# EAGLE design SEGmeter20 (EAGLE 5.11)
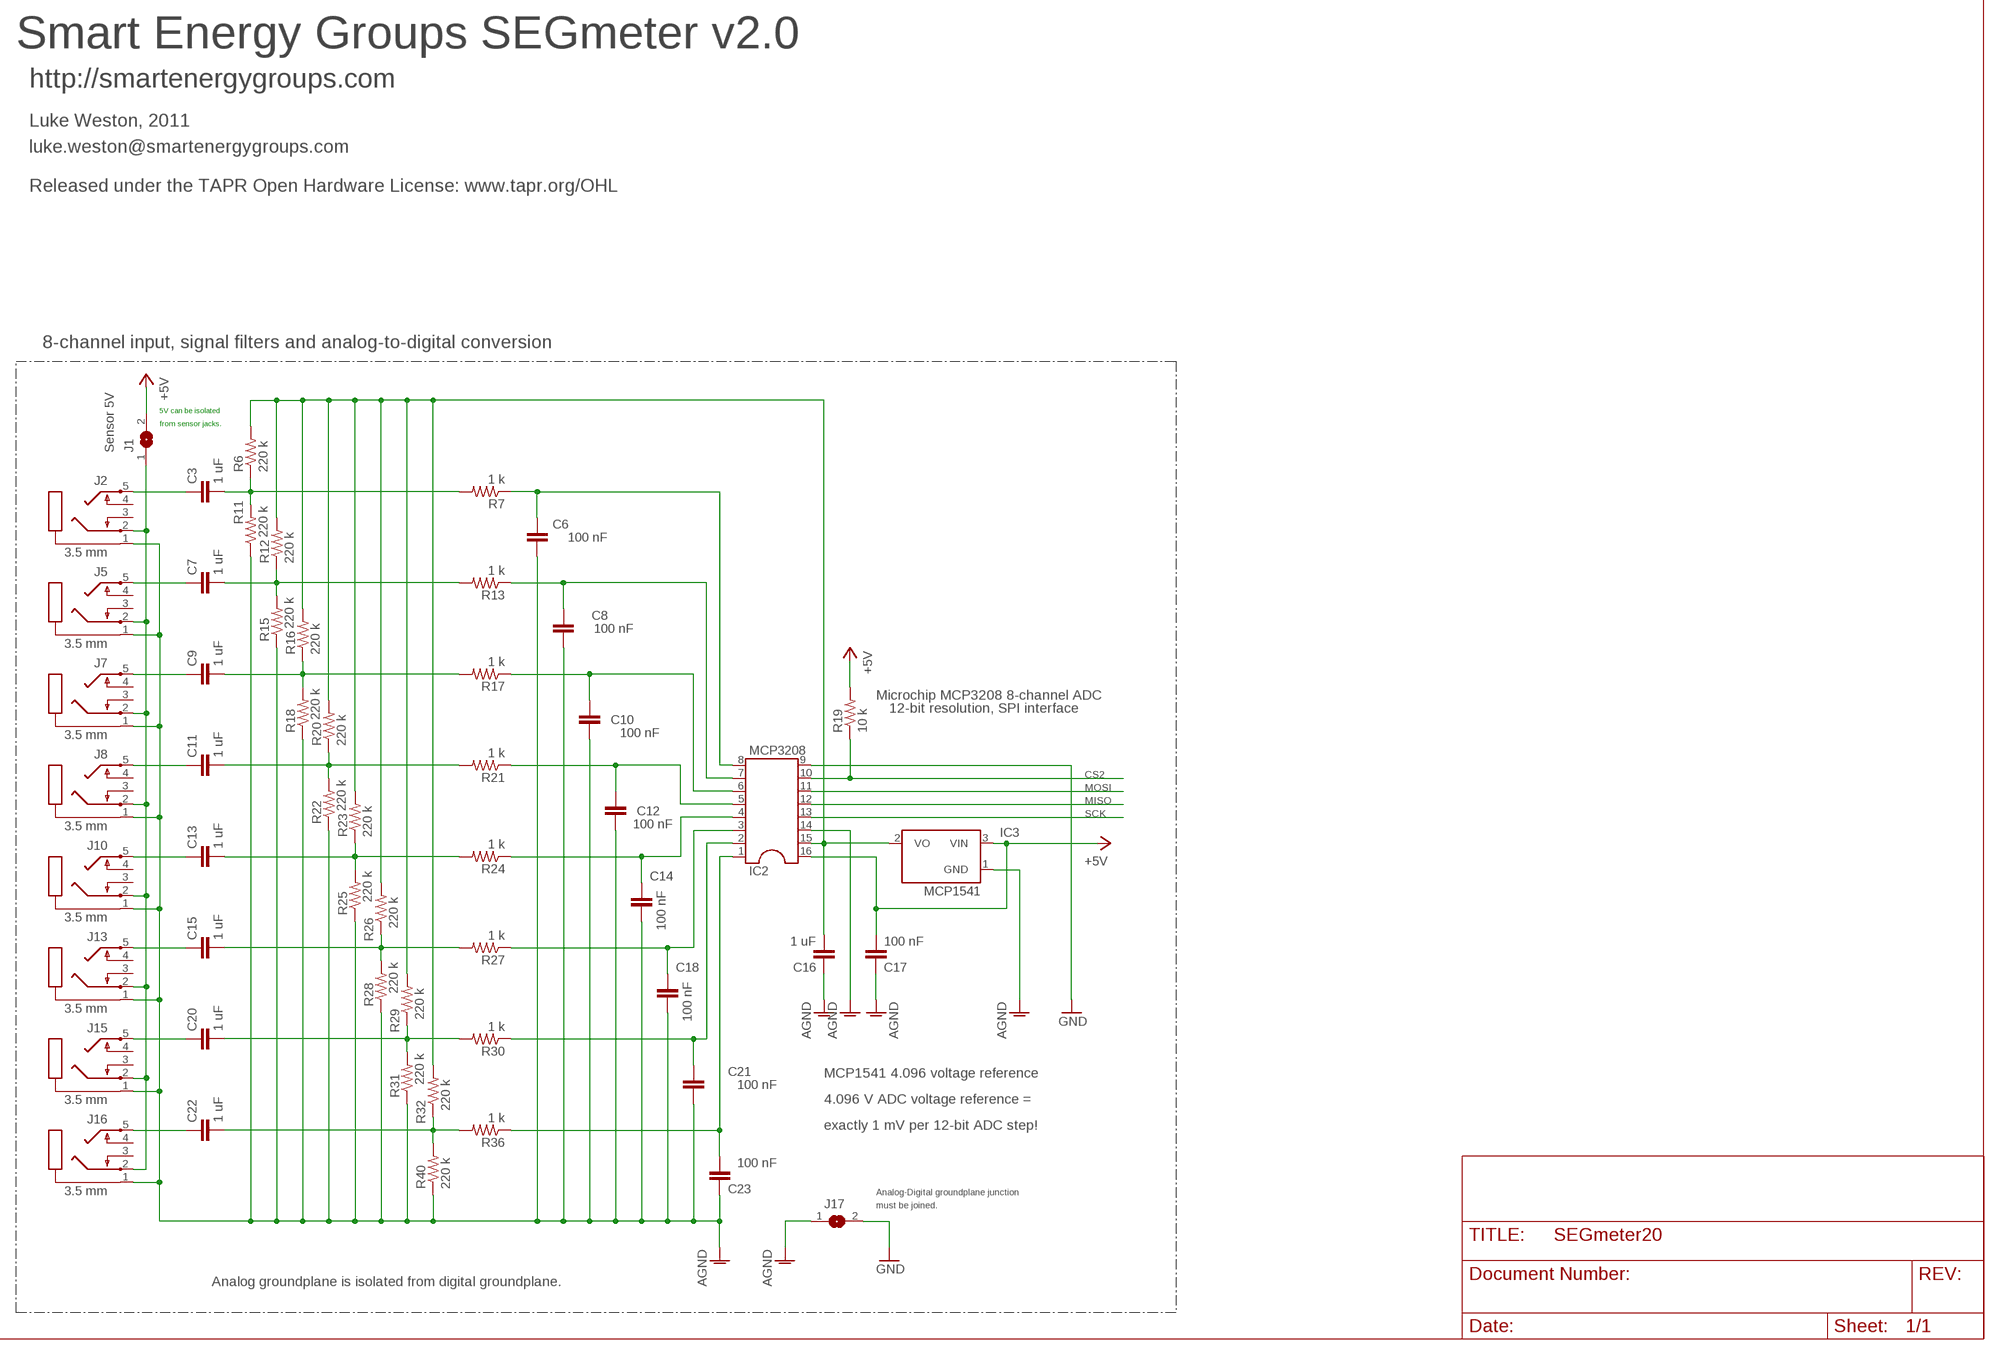
[diagram p0: schematic, sheet 1, part 1 of 2]
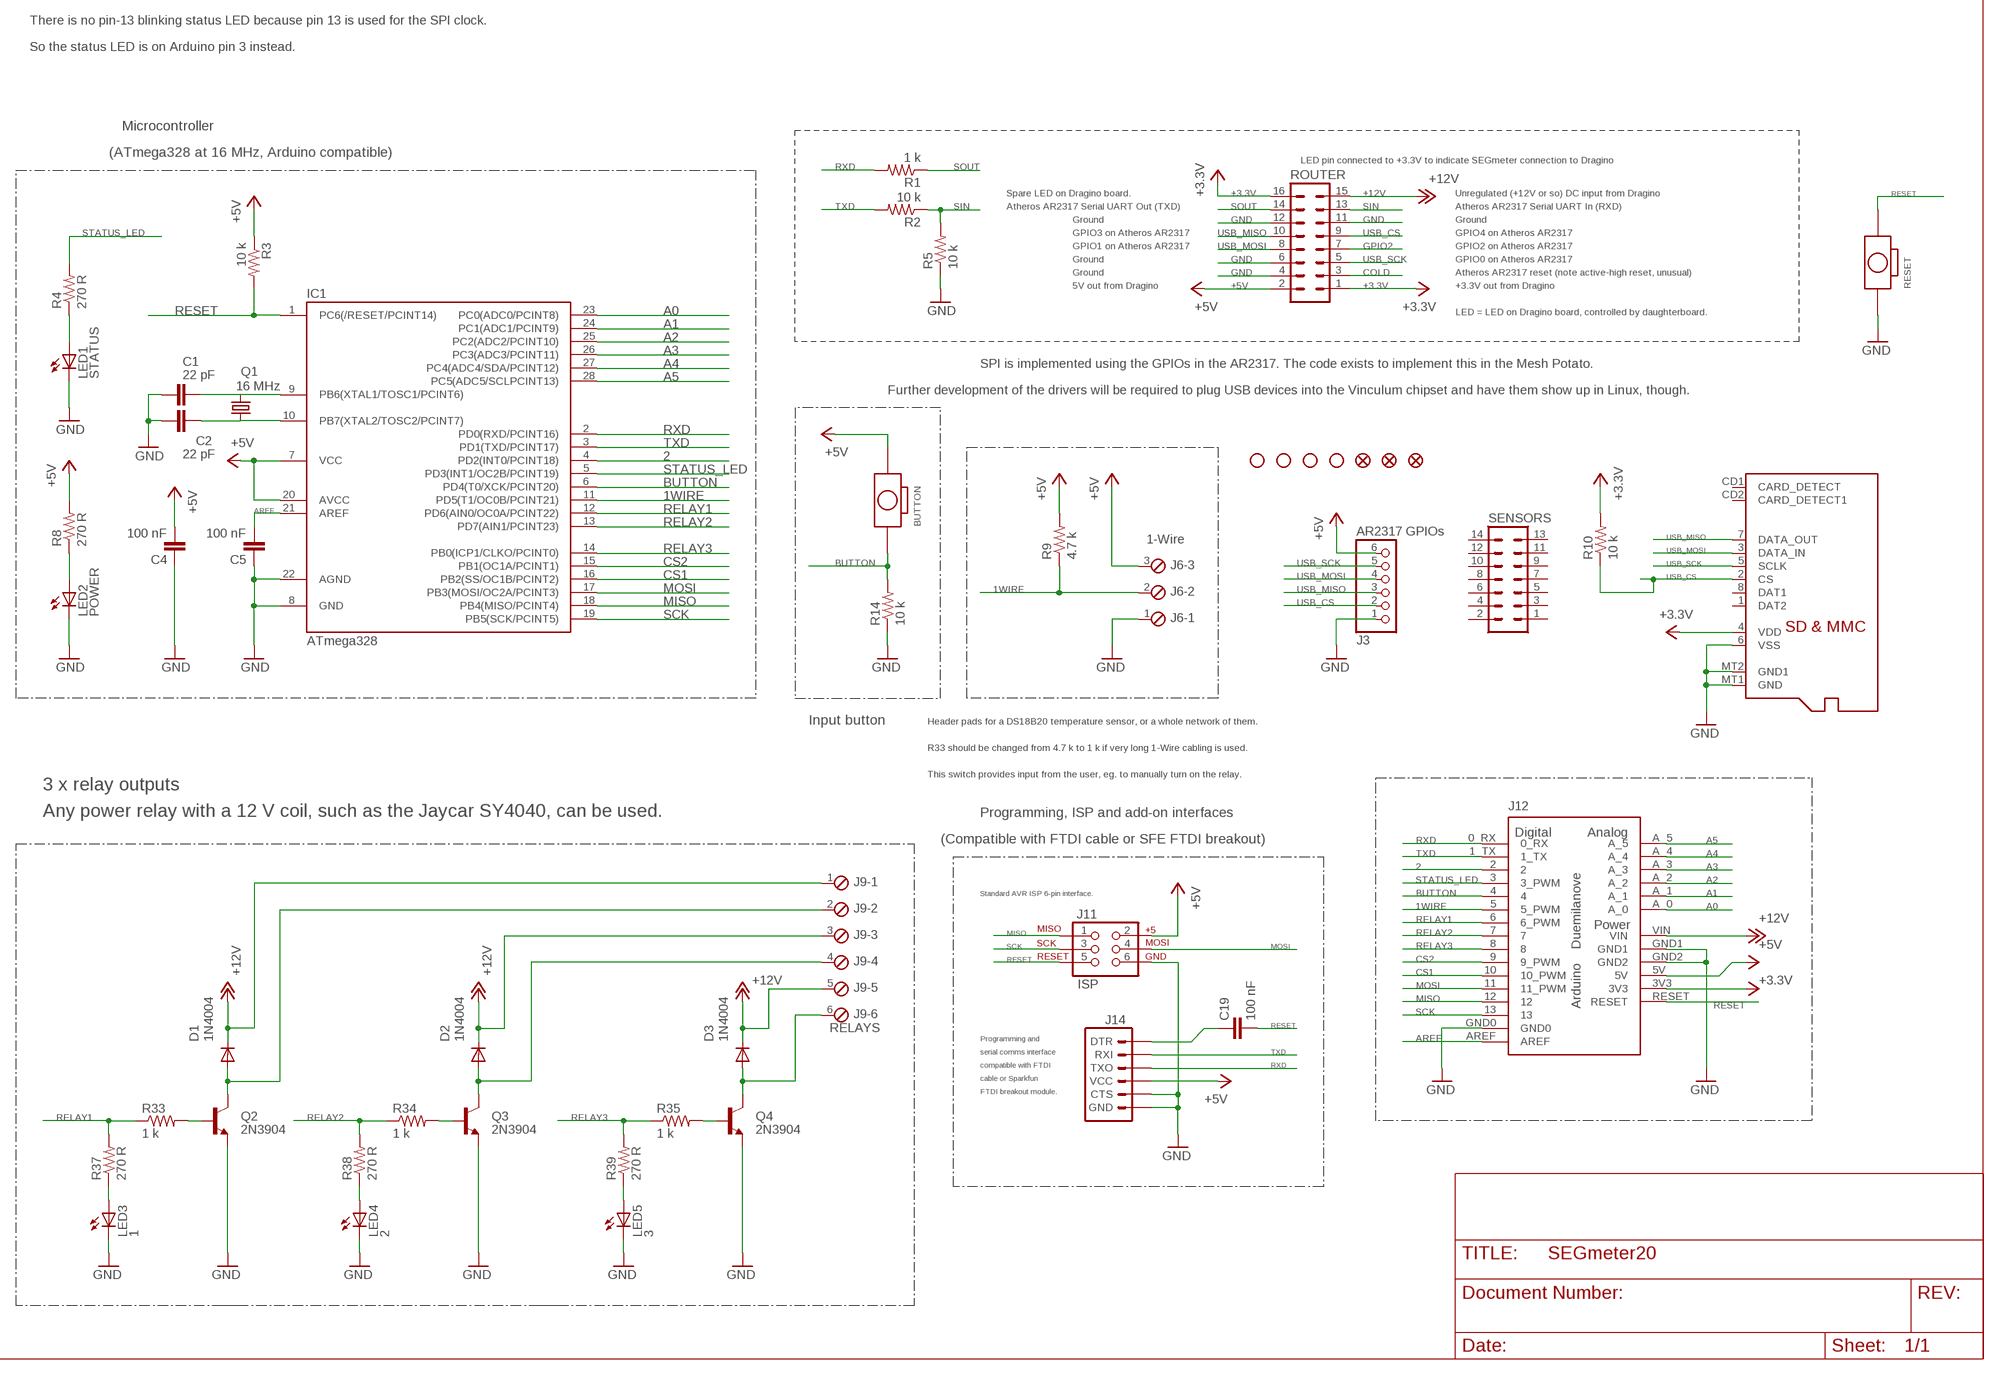
[diagram p1: schematic, sheet 1, part 2 of 2]

## Parts
BUTTON  BOTTON_1_DP  [BTN_5.0_RST]
C1  22 pF  C-EU025-024X044  [C025-024X044]
C2  22 pF  C-EU025-024X044  [C025-024X044]
C3  1 uF  C-EU050-024X044  [C050-024X044]
C4  100 nF  C-EU050-024X044  [C050-024X044]
C5  100 nF  C-EU050-024X044  [C050-024X044]
C6  100 nF  C-EU050-024X044  [C050-024X044]
C7  1 uF  C-EU050-024X044  [C050-024X044]
C8  100 nF  C-EU050-024X044  [C050-024X044]
C9  1 uF  C-EU050-024X044  [C050-024X044]
C10  100 nF  C-EU050-024X044  [C050-024X044]
C11  1 uF  C-EU050-024X044  [C050-024X044]
C12  100 nF  C-EU050-024X044  [C050-024X044]
C13  1 uF  C-EU050-024X044  [C050-024X044]
C14  100 nF  C-EU050-024X044  [C050-024X044]
C15  1 uF  C-EU050-024X044  [C050-024X044]
C16  1 uF  C-EU050-024X044  [C050-024X044]
C17  100 nF  C-EU050-024X044  [C050-024X044]
C18  100 nF  C-EU050-024X044  [C050-024X044]
C19  100 nF  C-EU050-024X044  [C050-024X044]
C20  1 uF  C-EU050-024X044  [C050-024X044]
C21  100 nF  C-EU050-024X044  [C050-024X044]
C22  1 uF  C-EU050-024X044  [C050-024X044]
C23  100 nF  C-EU050-024X044  [C050-024X044]
D1  1N4004  DIODEPTH  [DIODE-1N4001]
D2  1N4004  DIODEPTH  [DIODE-1N4001]
D3  1N4004  DIODEPTH  [DIODE-1N4001]
IC1  ATmega328  MEGA48/88/168-PU  [DIL28-3]
IC2  MCP3208  DIL16  [DIL16]
IC3  MCP1541  MC1541TO  [TO92]
J1  Sensor 5V  SJ  [SJ]
J2  3.5 mm  PG203J  [PG203J]
J3  AR2317 GPIOs  PINHD-1X6  [1X06]
J4  MICROSD  [MICROSD]
J5  3.5 mm  PG203J  [PG203J]
J6  1-Wire  MPT3  [3POL254]
J7  3.5 mm  PG203J  [PG203J]
J8  3.5 mm  PG203J  [PG203J]
J9  RELAYS  MPT6  [6POL254]
J10  3.5 mm  PG203J  [PG203J]
J11  ISP  AVR_SPI_PRG_6NS  [2X3-NS]
J12  ARDUINO-USBNO-OUTLINE-NO-TEXT-OCTAGONAL  [NO-OUTLINE-OCTAGONAL-NOTEXT]
J13  3.5 mm  PG203J  [PG203J]
J14  Comms  ARDUINO_SERIAL_PROGRAMLONGPADS  [1X06_LONGPADS]
J15  3.5 mm  PG203J  [PG203J]
J16  3.5 mm  PG203J  [PG203J]
J17  SJ  [SJ]
JP1  STAND-OFF  [STAND-OFF]
JP2  STAND-OFF  [STAND-OFF]
JP3  STAND-OFF  [STAND-OFF]
JP4  STAND-OFF  [STAND-OFF]
JP5  FIDUCIAL1.5X3  [FIDUCIAL-1.5X3]
JP6  FIDUCIAL1.5X3  [FIDUCIAL-1.5X3]
JP7  FIDUCIAL1.5X3  [FIDUCIAL-1.5X3]
LED1  STATUS  LED3MM  [LED3MM]
LED2  POWER  LED3MM  [LED3MM]
LED3  1  LED3MM  [LED3MM]
LED4  2  LED3MM  [LED3MM]
LED5  3  LED3MM  [LED3MM]
Q1  16 MHz  CRYSTALHC49US  [HC49US]
Q2  2N3904  TRANSISTOR_NPNTO92  [TO-92]
Q3  2N3904  TRANSISTOR_NPNTO92  [TO-92]
Q4  2N3904  TRANSISTOR_NPNTO92  [TO-92]
R1  1 k  R-US_0207/10  [0207/10]
R2  10 k  R-US_0207/10  [0207/10]
R3  10 k  R-US_0207/10  [0207/10]
R4  270 R  R-US_0207/10  [0207/10]
R5  10 k  R-US_0207/10  [0207/10]
R6  220 k  R-US_0207/10  [0207/10]
R7  1 k  R-US_0207/10  [0207/10]
R8  270 R  R-US_0207/10  [0207/10]
R9  4.7 k  R-US_0207/10  [0207/10]
R10  10 k  R-US_0207/10  [0207/10]
R11  220 k  R-US_0207/10  [0207/10]
R12  220 k  R-US_0207/10  [0207/10]
R13  1 k  R-US_0207/10  [0207/10]
R14  10 k  R-US_0207/10  [0207/10]
R15  220 k  R-US_0207/10  [0207/10]
R16  220 k  R-US_0207/10  [0207/10]
R17  1 k  R-US_0207/10  [0207/10]
R18  220 k  R-US_0207/10  [0207/10]
R19  10 k  R-US_0207/10  [0207/10]
R20  220 k  R-US_0207/10  [0207/10]
R21  1 k  R-US_0207/10  [0207/10]
R22  220 k  R-US_0207/10  [0207/10]
R23  220 k  R-US_0207/10  [0207/10]
R24  1 k  R-US_0207/10  [0207/10]
R25  220 k  R-US_0207/10  [0207/10]
R26  220 k  R-US_0207/10  [0207/10]
R27  1 k  R-US_0207/10  [0207/10]
R28  220 k  R-US_0207/10  [0207/10]
R29  220 k  R-US_0207/10  [0207/10]
R30  1 k  R-US_0207/10  [0207/10]
R31  220 k  R-US_0207/10  [0207/10]
R32  220 k  R-US_0207/10  [0207/10]
R33  1 k  R-US_0207/10  [0207/10]
R34  1 k  R-US_0207/10  [0207/10]
R35  1 k  R-US_0207/10  [0207/10]
R36  1 k  R-US_0207/10  [0207/10]
R37  270 R  R-US_0207/10  [0207/10]
R38  270 R  R-US_0207/10  [0207/10]
R39  270 R  R-US_0207/10  [0207/10]
R40  220 k  R-US_0207/10  [0207/10]
RESET  BOTTON_1_DP  [BTN_5.0_RST]
ROUTER  MA08-2  [MA08-2]
SENSORS  MA07-2  [MA07-2]

## Nets
1WIRE: IC1.11(PD5(T1/OC0B/PCINT21)) J6.2 J12.5(5_PWM) R9.1
2: IC1.4(PD2(INT0/PCINT18)) J12.2
+3.3V: J4.4(VDD) J12.3V3 R10.2 ROUTER.1 ROUTER.16
+5V: BUTTON.P$2 C4.2 C17.2 IC1.7(VCC) IC1.20(AVCC) IC2.16 IC3.3(VIN) J1.2 J3.6 J6.3 J11.2 J12.5V J14.4(VCC) R3.1 R8.2 R9.2 R19.2 ROUTER.2
+12V: D1.C D2.C D3.C J9.1 J9.3 J9.5 J12.VIN ROUTER.15
A0: IC1.23(PC0(ADC0/PCINT8)) J12.A_0
A1: IC1.24(PC1(ADC1/PCINT9)) J12.A_1
A2: IC1.25(PC2(ADC2/PCINT10)) J12.A_2
A3: IC1.26(PC3(ADC3/PCINT11)) J12.A_3
A4: IC1.27(PC4(ADC4/SDA/PCINT12)) J12.A_4
A5: IC1.28(PC5(ADC5/SCLPCINT13)) J12.A_5
AGND: C6.1 C8.1 C10.1 C12.1 C14.1 C16.1 C17.1 C18.1 C21.1 C23.1 IC2.14 IC3.1(GND) J2.1 J5.1 J7.1 J8.1 J10.1 J13.1 J15.1 J16.1 J17.1 R11.1 R15.1 R18.1 R22.1 R25.1 R28.1 R31.1 R40.1
AREF: C5.2 IC1.21(AREF) J12.AREF
BUTTON: BUTTON.P$1 IC1.6(PD4(T0/XCK/PCINT20)) J12.4 R14.2
COLD: ROUTER.3
CS1: IC1.16(PB2(SS/OC1B/PCINT2)) J12.10(10_PWM)
CS2: IC1.15(PB1(OC1A/PCINT1)) IC2.10 J12.9(9_PWM) R19.1
GND: C1.2 C2.2 C4.1 C5.1 IC1.8(GND) IC1.22(AGND) IC2.9 J3.1 J4.6(VSS) J4.MT1(GND) J4.MT2(GND1) J6.1 J11.6 J12.GND0 J12.GND1 J12.GND2 J14.5(CTS) J14.6(GND) J17.2 LED1.K(C) LED2.K(C) LED3.K(C) LED4.K(C) LED5.K(C) Q2.1(E) Q3.1(E) Q4.1(E) R5.1 R14.1 RESET.P$1 ROUTER.4 ROUTER.6 ROUTER.11 ROUTER.12
GPIO2: ROUTER.7
MISO: IC1.18(PB4(MISO/PCINT4)) IC2.12 J11.1 J12.12
MOSI: IC1.17(PB3(MOSI/OC2A/PCINT3)) IC2.11 J11.4 J12.11(11_PWM)
N$1: C3.2 R6.1 R7.2 R11.2
N$2: C20.1 J15.5
N$3: C22.1 J16.5
N$4: C16.2 IC2.15 IC3.2(VO) R6.2 R12.2 R16.2 R20.2 R23.2 R26.2 R29.2 R32.2
N$5: C7.2 R12.1 R13.2 R15.2
N$6: C6.2 IC2.8 R7.1
N$7: C15.1 J13.5
N$8: C13.1 J10.5
N$9: C11.1 J8.5
N$10: C3.1 J2.5
N$11: C7.1 J5.5
N$12: C9.1 J7.5
N$13: C8.2 IC2.7 R13.1
N$14: C10.2 IC2.6 R17.1
N$15: C12.2 IC2.5 R21.1
N$16: C23.2 IC2.1 R36.1
N$17: C21.2 IC2.2 R30.1
N$18: C15.2 R26.1 R27.2 R28.2
N$19: C18.2 IC2.3 R27.1
N$20: C14.2 IC2.4 R24.1
N$21: C22.2 R32.1 R36.2 R40.2
N$22: C20.2 R29.1 R30.2 R31.2
N$23: D1.A J9.2 Q2.3(C)
N$24: C13.2 R23.1 R24.2 R25.2
N$25: LED3.A R37.1
N$26: C11.2 R20.1 R21.2 R22.2
N$27: C9.2 R16.1 R17.2 R18.2
N$28: C1.1 IC1.9(PB6(XTAL1/TOSC1/PCINT6)) Q1.2
N$29: C2.1 IC1.10(PB7(XTAL2/TOSC2/PCINT7)) Q1.1
N$30: C19.1 J14.1(DTR)
N$31: D2.A J9.4 Q3.3(C)
N$32: Q2.2(B) R33.2
N$33: LED4.A R38.1
N$34: Q3.2(B) R34.2
N$35: D3.A J9.6 Q4.3(C)
N$36: LED5.A R39.1
N$37: Q4.2(B) R35.2
N$38: LED2.A R8.1
N$39: LED1.A R4.1
N$40: J1.1 J2.2 J5.2 J7.2 J8.2 J10.2 J13.2 J15.2 J16.2
RELAY1: IC1.12(PD6(AIN0/OC0A/PCINT22)) J12.6(6_PWM) R33.1 R37.2
RELAY2: IC1.13(PD7(AIN1/PCINT23)) J12.7 R34.1 R38.2
RELAY3: IC1.14(PB0(ICP1/CLKO/PCINT0)) J12.8 R35.1 R39.2
RESET: C19.2 IC1.1(PC6(/RESET/PCINT14)) J11.5 J12.RESET R3.2 RESET.P$2
RXD: IC1.2(PD0(RXD/PCINT16)) J12.0_RX J14.3(TXO) R1.2
SCK: IC1.19(PB5(SCK/PCINT5)) IC2.13 J11.3 J12.13
SIN: R2.1 R5.2 ROUTER.13
SOUT: R1.1 ROUTER.14
STATUS_LED: IC1.5(PD3(INT1/OC2B/PCINT19)) J12.3(3_PWM) R4.2
TXD: IC1.3(PD1(TXD/PCINT17)) J12.1_TX J14.2(RXI) R2.2
USB_CS: J3.2 J4.2(CS) R10.1 ROUTER.9
USB_MISO: J3.3 J4.7(DATA_OUT) ROUTER.10
USB_MOSI: J3.4 J4.3(DATA_IN) ROUTER.8
USB_SCK: J3.5 J4.5(SCLK) ROUTER.5
Unconnected: J2.3 J2.4 J4.1(DAT2) J4.8(DAT1) J4.CD1(CARD_DETECT) J4.CD2(CARD_DETECT1) J5.3 J5.4 J7.3 J7.4 J8.3 J8.4 J10.3 J10.4 J13.3 J13.4 J15.3 J15.4 J16.3 J16.4 SENSORS.1 SENSORS.2 SENSORS.3 SENSORS.4 SENSORS.5 SENSORS.6 SENSORS.7 SENSORS.8 SENSORS.9 SENSORS.10 SENSORS.11 SENSORS.12 SENSORS.13 SENSORS.14

## Notes on the sheet
- Smart Energy Groups SEGmeter v2.0
- http://smartenergygroups.com
- Luke Weston, 2011
- luke.weston@smartenergygroups.com
- Released under the TAPR Open Hardware License: www.tapr.org/OHL
- 8-channel input, signal filters and analog-to-digital conversion
- 5V can be isolated
- from sensor jacks.
- Microchip MCP3208 8-channel ADC
- 12-bit resolution, SPI interface
- MCP1541 4.096 voltage reference
- 4.096 V ADC voltage reference =
- exactly 1 mV per 12-bit ADC step!
- Analog-Digital groundplane junction
- must be joined.
- Analog groundplane is isolated from digital groundplane.
- There is no pin-13 blinking status LED because pin 13 is used for the SPI clock.
- So the status LED is on Arduino pin 3 instead.
- Microcontroller
- (ATmega328 at 16 MHz, Arduino compatible) | LED pin connected to +3.3V to indicate SEGmeter connection to Dragino
- Spare LED on Dragino board. | Unregulated (+12V or so) DC input from Dragino
- Atheros AR2317 Serial UART Out (TXD) | Atheros AR2317 Serial UART In (RXD)
- Ground | Ground
- GPIO3 on Atheros AR2317 | GPIO4 on Atheros AR2317
- GPIO1 on Atheros AR2317 | GPIO2 on Atheros AR2317
- Ground | GPIO0 on Atheros AR2317
- Ground | Atheros AR2317 reset (note active-high reset, unusual)
- 5V out from Dragino | +3.3V out from Dragino
- LED = LED on Dragino board, controlled by daughterboard.
- SPI is implemented using the GPIOs in the AR2317. The code exists to implement this in the Mesh Potato.
- Further development of the drivers will be required to plug USB devices into the Vinculum chipset and have them show up in Linux, though.
- Input button | Header pads for a DS18B20 temperature sensor, or a whole network of them.
- R33 should be changed from 4.7 k to 1 k if very long 1-Wire cabling is used.
- This switch provides input from the user, eg. to manually turn on the relay.
- 3 x relay outputs
- Any power relay with a 12 V coil, such as the Jaycar SY4040, can be used. | Programming, ISP and add-on interfaces
- (Compatible with FTDI cable or SFE FTDI breakout)
- Standard AVR ISP 6-pin interface.
- Programming and
- serial comms interface
- compatible with FTDI
- cable or Sparkfun
- FTDI breakout module.

## Library data of the parts
BUTTON RESET = CPT_SMD:BOTTON_1
C1-C23 = rcl:C-EU: CAPACITOR, European symbol
D1-D3 = SparkFun:DIODE: Diode These are standard reverse protection diodes and small signal diodes. SMA package can handle up to about 1A. SOD-323 can handle about 200mA. What the SOD-323 package when ordering, there are some mfgs out there that are 5-pin packages.
IC1 = avr-5:MEGA48/88/168-PU
IC2 = ic-package:DIL16: Dual In Line / Socket
IC3 = microchip:MC15*: 2.5V and 4.096V Voltage References Source: http://www.microchip.com .. 21653b.pdf; OC_FARNELL: unknown; OC_NEWARK: unknown
J1 J17 = jumper:SJ: SMD solder JUMPER
J2 J5 J7 J8 J10 J13 J15 J16 = con-hirschmann:PG203J: MIC/HEADPHONE JACK KS-S stereo microphone/headphone jack PG203JN (Schukat); OC_FARNELL: unknown; OC_NEWARK: unknown
J3 = pinhead:PINHD-1X6: PIN HEADER
J4 = adafruit:MICROSD: Micro-SD / Transflash card holder with SPI pinout For the 3M # 2908-05WB-MG and/or 4UCON #19656 push-push type
J6 = con-phoenix-254:MPT3: PHOENIX CONNECTOR; OC_FARNELL: unknown; OC_NEWARK: unknown
J9 = con-phoenix-254:MPT6: PHOENIX CONNECTOR; OC_FARNELL: unknown; OC_NEWARK: unknown
J11 = SparkFun:AVR_SPI_PRG_6: AVR ISP 6 Pin This is the reduced ISP connector for AVR programming. Common on Arduino. This footprint will take up less PCB space and can be used with a 10-pin to 6-pin adapter such as SKU: BOB-08508
J12 = Arduino-Various:ARDUINO-USB: The Ardiuno Duemilanove Pinouts layoutet as a Bare Shield. v0.5 Also for Arduino Diecimila. This is designed as a Part and has no Outline in the Dimension Layer. The Outline, when present, is drawed at the tPlace / bPlace Layer. Library by Stephanie Lange, http://www.k-ita.de/~sl/
J14 = SparkFun:ARDUINO_SERIAL_PROGRAM
JP1-JP4 = SparkFun:STAND-OFF: Stand Off This is the mechanical footprint for a #4 phillips button head screw. Use the keepout ring to avoid running the screw head into surrounding components. SKU : PRT-00447
JP5-JP7 = SparkFun:FIDUCIAL: Fiducial Alignment Points Various fiducial points for machine vision alignment.
LED1-LED5 = SparkFun:LED: LEDs Standard schematic elements and footprints for 5mm, 3mm, 1206, and 0603 sized LEDs. 5mm - Spark Fun Electronics SKU : COM-00529 (and others)
Q1 = SparkFun:CRYSTAL: Crystals Various standard crystals. Proven footprints. Spark Fun Electronics SKU : COM-00534
Q2-Q4 = SparkFun:TRANSISTOR_NPN: Transistor NPN BJT configuration in SOT23 package. MMBT2222 is the common NPN we use. Double check BCE configuration again layout.
R1-R40 = rcl:R-US_: RESISTOR, American symbol
ROUTER = con-lstb:MA08-2: PIN HEADER; OC_FARNELL: unknown; OC_NEWARK: unknown
SENSORS = con-lstb:MA07-2: PIN HEADER; OC_FARNELL: unknown; OC_NEWARK: unknown

## Board
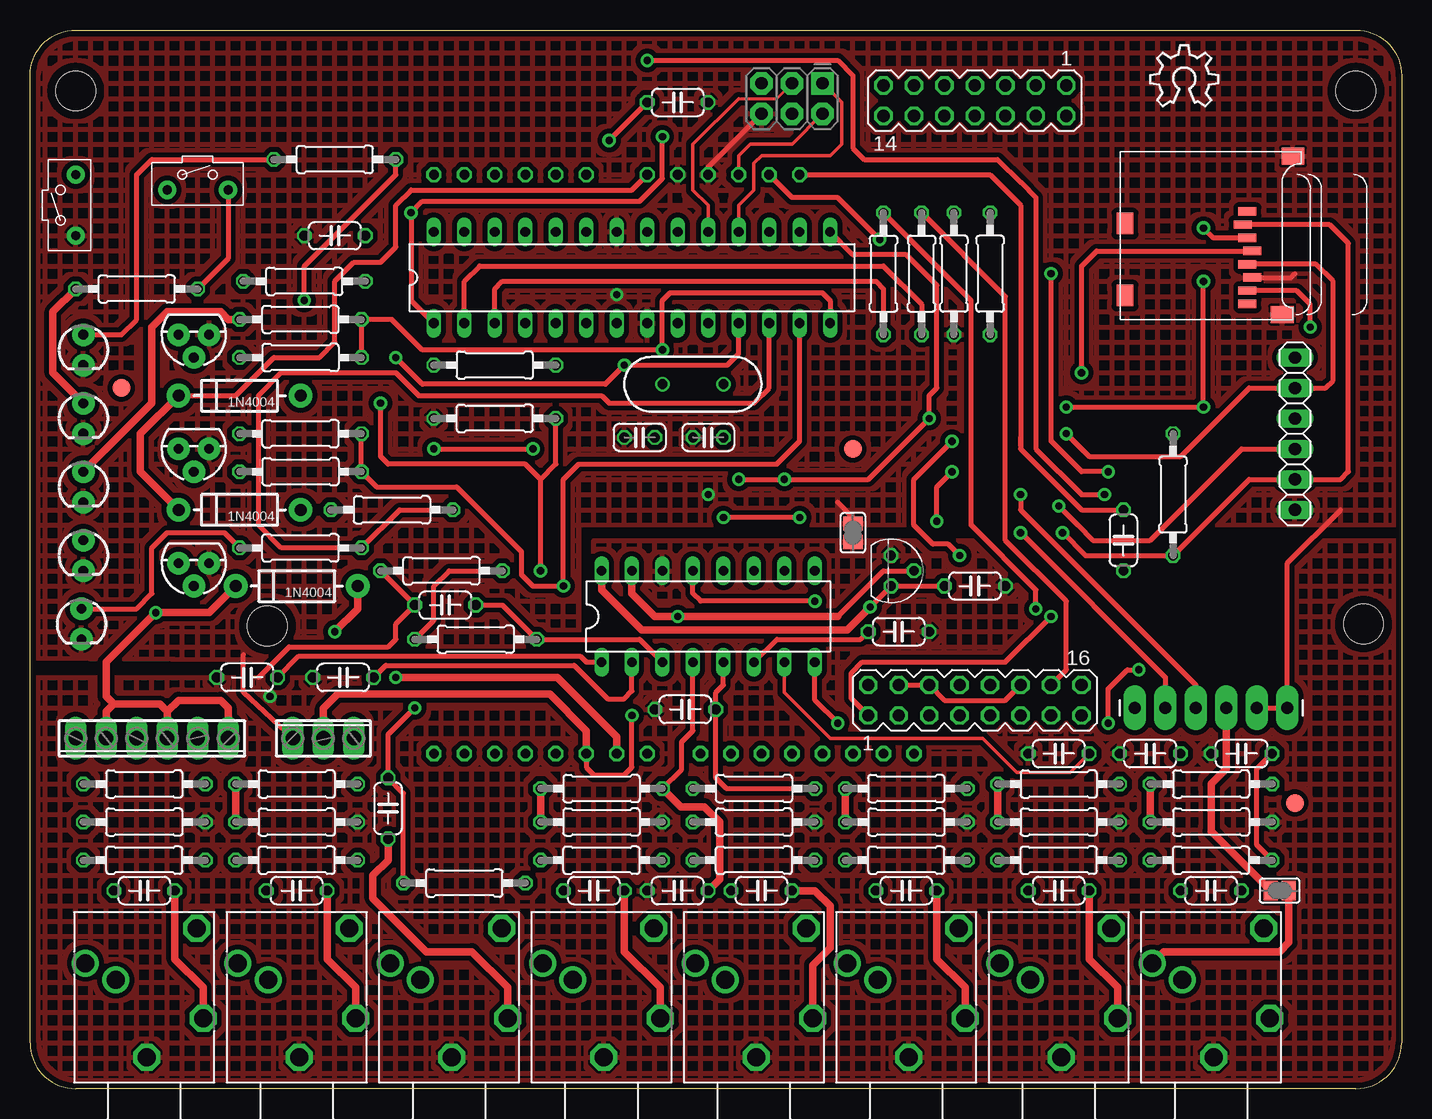
[diagram p2: board, top side]
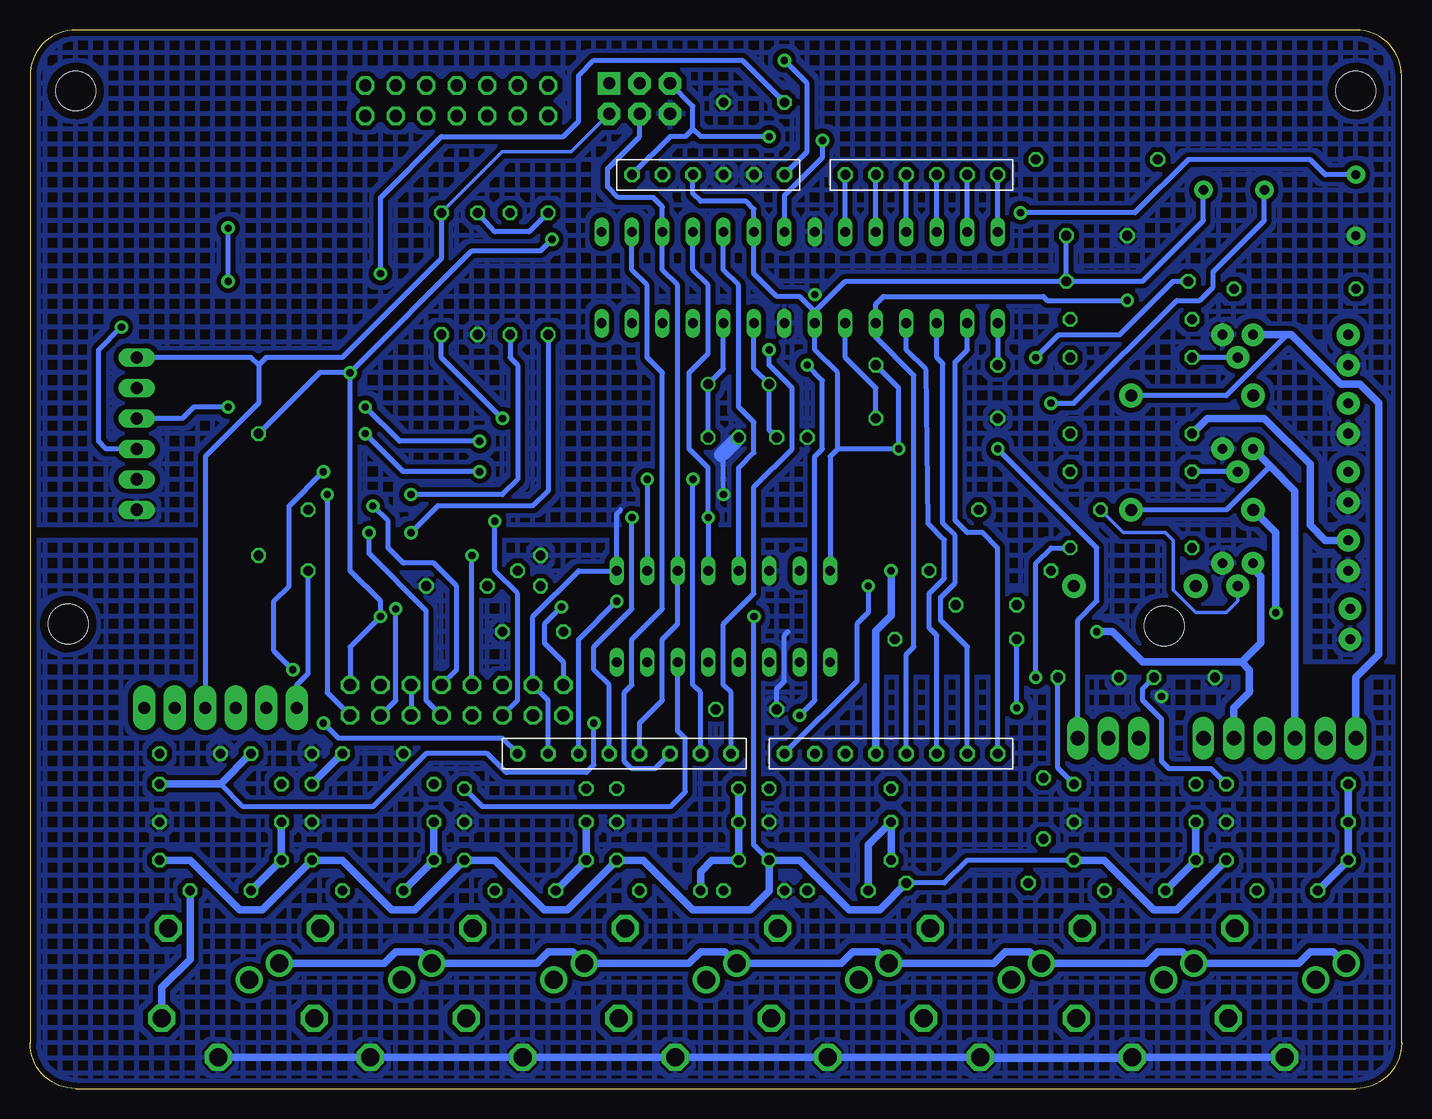
[diagram p3: board, bottom side, seen from below]

Size 114.3 x 88.27 mm. Coordinates in mm from the lower left corner, seen from the top.
Outline: 110.49,0 3.81,0 arc-90 0,3.81 0,84.46 arc-90 3.81,88.27 110.49,88.27 arc-90 114.3,84.46 114.3,3.81 arc-90 110.49,0
Copper layers (1*16): Top 0.035mm / dielectric 1.5mm / Bottom 0.035mm
Design rules "PCBCart-Standard": minimum track width 8mil, minimum drill 0.4mm, track to track 8mil, track to pad 8mil, pad to pad 8mil, via to via 8mil, smd to smd 8mil, copper to edge 20mil, drill to drill 8mil, minimum pad ring 8mil, minimum via ring 10mil, stop-mask expansion 3mil, vias tented up to drill 0mil, thermal gap 8mil

### Footprints (pad centres in the part's own frame; a part is rotated, then mirrored left to right if it is on the bottom)
BTN_5.0_RST = drill 0.762 pad 1.524 round: P$1 0,2.54; P$2 0,-2.54
C025-024X044 = drill 0.813 octagon: 1 -1.27,0; 2 1.27,0
C050-024X044 = drill 0.813 octagon: 1 -2.54,0; 2 2.54,0
DIODE-1N4001 = drill 1 pad 1.981 round: A -5.08,0; C 5.08,0
DIL28-3 = drill 0.813 long: 1 -16.51,-3.81; 2 -13.97,-3.81; 3 -11.43,-3.81; 4 -8.89,-3.81; 5 -6.35,-3.81; 6 -3.81,-3.81; 7 -1.27,-3.81; 8 1.27,-3.81; 9 3.81,-3.81; 10 6.35,-3.81; 11 8.89,-3.81; 12 11.43,-3.81; 13 13.97,-3.81; 14 16.51,-3.81; 15 16.51,3.81; 16 13.97,3.81; 17 11.43,3.81; 18 8.89,3.81; 19 6.35,3.81; 20 3.81,3.81; 21 1.27,3.81; 22 -1.27,3.81; 23 -3.81,3.81; 24 -6.35,3.81; 25 -8.89,3.81; 26 -11.43,3.81; 27 -13.97,3.81; 28 -16.51,3.81
DIL16 = drill 0.813 long: 1 -8.89,-3.81; 2 -6.35,-3.81; 3 -3.81,-3.81; 4 -1.27,-3.81; 5 1.27,-3.81; 6 3.81,-3.81; 7 6.35,-3.81; 8 8.89,-3.81; 9 8.89,3.81; 10 6.35,3.81; 11 3.81,3.81; 12 1.27,3.81; 13 -1.27,3.81; 14 -3.81,3.81; 15 -6.35,3.81; 16 -8.89,3.81
TO92 = drill 0.813 octagon: 1 -1.27,0; 2 0,1.905; 3 1.27,0
SJ = smd 1.168 x 1.6: 1 -0.762,0; 2 0.762,0
PG203J = drill 1.499 octagon: 1 -5.004,-0.203; 4 5.74,-4.369; 5 -1.753,-4.902 | drill 1.499 round: 2 2.845,4.902; 3 1.448,2.388
1X06 = drill 1.016 long: 1 -6.35,0; 2 -3.81,0; 3 -1.27,0; 4 1.27,0; 5 3.81,0; 6 6.35,0
MICROSD = smd 0.7 x 1.5: 1 9,-10.64; 2 7.9,-10.24; 3 6.8,-10.64; 4 5.7,-11.04; 5 4.6,-10.64; 6 3.5,-11.04; 7 2.4,-10.64; 8 1.3,-10.64 | smd 1.8 x 1.4: CD1 2,-0.44; CD2 8,-0.44 | smd 1.4 x 1.9: MT1 0.4,-13.54; MT2 13.6,-14.44
3POL254 = drill 1.2 long: 1 -2.54,0; 2 0,0; 3 2.54,0
6POL254 = drill 1.2 pad 1.778 long: 1 -6.35,0; 2 -3.81,0; 3 -1.27,0; 4 1.27,0; 5 3.81,0; 6 6.35,0
2X3-NS = drill 1.016 pad 1.88 square: 1 -2.54,-1.27 | drill 1.016 pad 1.88 octagon: 2 -2.54,1.27; 3 0,-1.27; 4 0,1.27; 5 2.54,-1.27; 6 2.54,1.27
NO-OUTLINE-OCTAGONAL-NOTEXT = drill 0.8 pad 1.27 octagon: 0_RX -25.4,27.94; 1_TX -25.4,25.4; 2 -25.4,22.86; 3 -25.4,20.32; 3V3 22.86,0; 4 -25.4,17.78; 5 -25.4,15.24; 5V 22.86,2.54; 6 -25.4,12.7; 7 -25.4,10.16; 8 -25.4,5.715; 9 -25.4,3.175; 10 -25.4,0.635; 11 -25.4,-1.905; 12 -25.4,-4.445; 13 -25.4,-6.985; A_0 22.86,15.24; A_1 22.86,17.78; A_2 22.86,20.32; A_3 22.86,22.86; A_4 22.86,25.4; A_5 22.86,27.94; AREF -25.4,-12.065; GND0 -25.4,-9.525; GND1 22.86,7.62; GND2 22.86,5.08; RESET 22.86,-2.54; VIN 22.86,10.16
1X06_LONGPADS = drill 1.016 pad 1.88 long: 1 0,0; 2 2.54,0; 3 5.08,0; 4 7.62,0; 5 10.16,0; 6 12.7,0
STAND-OFF = hole 3.302: 0,0
FIDUCIAL-1.5X3 = smd 1.5 x 1.5: 1 0,0
LED3MM = drill 0.813 pad 1.88 round: A -1.27,0; K 1.27,0
HC49US = drill 0.813 round: 1 -2.54,0; 2 2.54,0
TO-92 = drill 0.813 pad 1.88 round: 1 -1.27,0; 2 0,1.905; 3 1.27,0
0207/10 = drill 0.813 octagon: 1 -5.08,0; 2 5.08,0
MA08-2 = drill 1.016 octagon: 1 -8.89,-1.27; 2 -8.89,1.27; 3 -6.35,-1.27; 4 -6.35,1.27; 5 -3.81,-1.27; 6 -3.81,1.27; 7 -1.27,-1.27; 8 -1.27,1.27; 9 1.27,-1.27; 10 1.27,1.27; 11 3.81,-1.27; 12 3.81,1.27; 13 6.35,-1.27; 14 6.35,1.27; 15 8.89,-1.27; 16 8.89,1.27
MA07-2 = drill 1.016 octagon: 1 -7.62,-1.27; 2 -7.62,1.27; 3 -5.08,-1.27; 4 -5.08,1.27; 5 -2.54,-1.27; 6 -2.54,1.27; 7 0,-1.27; 8 0,1.27; 9 2.54,-1.27; 10 2.54,1.27; 11 5.08,-1.27; 12 5.08,1.27; 13 7.62,-1.27; 14 7.62,1.27

### Placement (x,y rotation side)
BUTTON  13.97,74.93 90 top
C1  50.8,54.29 180 top
C2  56.52,54.29 180 top
C3  98.42,16.51 180 top
C4  25.4,71.12 0 top
C5  53.98,82.23 180 top
C6  93.34,27.94 0 top
C7  85.73,16.51 180 top
C8  85.73,27.94 0 top
C9  73.03,16.51 180 top
C10  72.39,38.1 180 top
C11  60.96,16.51 180 top
C12  54.61,31.62 0 top
C13  46.99,16.51 180 top
C14  53.98,16.51 0 top
C15  29.84,23.37 90 top
C16  100.97,27.94 0 top
C17  78.74,41.91 180 top
C18  34.61,40.32 0 top
C19  91.12,45.72 90 top
C20  22.22,16.51 180 top
C21  26.1,34.29 0 top
C22  9.53,16.51 180 top
C23  18.1,34.29 0 top
D1  22.22,41.91 180 top
D2  17.46,48.26 180 top
D3  17.46,57.78 180 top
IC1  50.16,67.63 0 top
IC2  56.52,39.37 0 top
IC3  71.75,43.18 270 top
J1  104.14,16.51 180 top
J2  98.42,7.62 90 top
J3  105.41,54.61 90 top
J4  90.81,64.14 90 top
J5  85.73,7.62 90 top
J6  24.45,29.21 0 top
J7  73.03,7.62 90 top
J8  60.33,7.62 90 top
J9  10.16,29.21 180 top
J10  47.62,7.62 90 top
J11  63.5,82.55 180 top
J12  61.59,53.34 90 top
J13  34.92,7.62 90 top
J14  92.08,31.75 0 top
J15  22.22,7.62 90 top
J16  9.53,7.62 90 top
J17  68.58,46.35 90 top
JP1  19.78,38.58 0 top
JP2  3.81,83.19 0 top
JP3  110.49,83.19 0 top
JP4  111.12,38.73 180 top
JP5  7.62,58.42 0 top
JP6  105.41,23.81 0 top
JP7  68.58,53.34 0 top
LED1  4.45,61.59 270 top
LED2  4.45,55.88 270 top
LED3  4.29,38.73 270 top
LED4  4.45,44.45 270 top
LED5  4.45,50.16 270 top
Q1  55.25,58.74 180 top
Q2  13.65,43.81 180 top
Q3  13.65,53.34 180 top
Q4  13.65,62.87 180 top
R1  74.3,67.95 270 top
R2  71.12,67.95 270 top
R3  38.73,60.32 180 top
R4  25.4,77.47 0 top
R5  76.99,67.95 90 top
R6  98.42,19.05 0 top
R7  98.42,25.4 180 top
R8  8.89,66.68 0 top
R9  22.86,67.31 0 top
R10  95.25,49.53 90 top
R11  98.42,22.22 180 top
R12  85.73,19.05 0 top
R13  85.73,25.4 180 top
R14  38.73,55.88 0 top
R15  85.73,22.22 180 top
R16  73.03,19.05 0 top
R17  73.03,25.02 180 top
R18  73.03,22.22 180 top
R19  80.01,67.95 90 top
R20  60.33,19.05 0 top
R21  60.33,25.02 180 top
R22  60.33,22.22 180 top
R23  47.62,19.05 0 top
R24  47.62,25.02 180 top
R25  47.62,22.22 180 top
R26  36.2,17.14 0 top
R27  37.15,37.46 180 top
R28  34.29,43.18 0 top
R29  22.22,19.05 0 top
R30  22.22,25.4 180 top
R31  22.22,22.22 180 top
R32  9.53,19.05 0 top
R33  30.16,48.26 180 top
R34  22.54,51.44 180 top
R35  22.54,60.96 180 top
R36  9.53,25.4 180 top
R37  22.54,45.09 0 top
R38  22.54,54.61 0 top
R39  22.54,64.14 0 top
R40  9.53,22.22 180 top
RESET  3.81,73.66 180 top
ROUTER  78.74,32.38 0 top
SENSORS  78.74,82.37 180 top
U$1  [OSHW_8X200_NOTEXT]  93.34,81.92 0 top

### Tracks (layer width: path | path; a pad name or v marks a point on that pad's centre or on a via)
1WIRE  (via drill 0.6)
  Top 0.406: IC1.11 59.05,61.28 58.1,60.32 v49.53,60.32 47.94,58.74 32.7,58.74 v30.48,60.96 | v50.16,31.11 50.16,26.8 49.53,26.16 46.99,26.16 46.36,26.8 J12.5
  Top 0.61: J6.2 24.45,31.69 25.65,32.89 43.31,32.89 46.36,29.84 J12.5
  Bottom 0.406: v49.53,60.32 48.26,59.05 48.26,53.34 48.9,52.7 48.9,32.38 v50.16,31.11 | v30.48,60.96 28.57,62.87 24.13,62.87 23.49,62.87 19.05,67.31 R9.1
2
  Bottom 0.406: IC1.4 41.28,61.59 39.62,59.94 39.47,47.12 38.1,45.75 38.1,42.55 39.37,41.27 39.37,38.42 38.73,37.78 J12.2
+3.3V  (via drill 0.6)
  Top 0.406: v70.8,70.8 67.31,74.3 63.5,74.3 J12.3V3 | ROUTER.1 | ROUTER.1 68.42,32.54 68.42,34.61 69.37,35.56 81.28,35.56 v85.09,39.37 | J4.4 88.89,69.84 87.63,68.58 v87.63,59.69
  Bottom 0.406: v70.8,70.8 71.75,69.85 77.47,69.85 v87.63,59.69 | ROUTER.16 87.63,36.83 v85.09,39.37 85.09,40.64 87.63,43.18 v87.63,59.69 | R10.2 90.17,59.69 v87.63,59.69
+5V  (via drill 0.6)
  Top 0.305: J12.5V 59.05,77.79 60.01,78.74 63.5,78.74 J11.2
  Top 0.406: IC3.3 C17.2 | C17.2 | IC3.3 | v70.01,40.16 IC3.3 | v33.66,53.34 v41.91,53.34 | R8.2 16.51,69.22 BUTTON.P$2
  Top 0.61: IC2.16 47.62,41.59 50.96,38.26 68.1,38.26 | J14.4 99.7,26.67 98.42,25.4 98.42,21.46 J1.2 | 68.1,38.26 | 68.1,38.26 v70.01,40.16
  Bottom 0.305: J11.2 69.22,78.11 74.93,78.11 R19.2
  Bottom 0.406: 46.99,53.34 47.62,52.7 IC2.16 | R3.1 41.91,58.42 v41.91,53.34 46.99,53.34 | 48.9,64.77 46.36,67.31 R9.2 | 48.9,64.77 IC1.7 48.9,61.59 46.99,59.69 46.99,53.34 | 48.9,64.77 50.16,66.04 52.07,66.04 53.98,67.95 IC1.20 53.98,73.34 54.61,73.98 58.42,73.98 59.05,74.61 J12.5V | J14.4 99.7,52.7 95.25,57.15 95.25,60.32 | 95.25,60.32 94.62,60.96 88.27,60.96 80.01,69.22 R19.2 | J3.6 95.89,60.96 95.25,60.32 | v70.01,40.16 | v70.01,40.16 71.44,38.73 71.44,37.15 69.85,35.56 ROUTER.2 | R9.2 C4.2 | J6.3 26.99,39.05 25.4,40.64 25.4,45.09 v33.66,53.34 | R9.2 21.59,67.31 16.51,72.39 BUTTON.P$2 | IC3.3
+12V  (via drill 0.6)
  Top 0.406: D3.C 17.14,57.78 20.32,60.96 24.13,60.96 25.4,62.23 25.4,67.31 26.99,68.9 29.21,68.9 30.48,70.17 30.48,73.66 31.75,74.93 50.16,74.93 J12.VIN | v51.44,85.73 67.31,85.73 68.58,84.46 68.58,78.42 69.53,77.47 80.64,77.47 82.55,75.57 83.82,74.3 83.82,53.34 87.63,49.53 v89.53,49.53
  Top 0.61: D2.C 9.21,51.44 9.21,54.61 D3.C | J9.5 6.35,31.43 6.98,32.07 | 6.98,32.07 10.79,32.07 11.43,31.43 | 11.43,31.43 J9.3 | 11.43,31.43 12.38,32.38 15.88,32.38 16.51,31.75 J9.1 | 6.98,32.07 6.35,32.7 6.35,35.56 v10.48,39.69 14.92,39.69 D1.C
  Bottom 0.406: v51.44,85.73 49.53,83.82 49.53,78.11 J12.VIN | v89.53,49.53 89.53,33.02 ROUTER.15
  Bottom 0.61: v10.48,39.69 10.48,46.35 D2.C
A0
  Bottom 0.406: IC1.23 J12.A_0
A1
  Bottom 0.406: IC1.24 J12.A_1
A2
  Bottom 0.406: IC1.25 J12.A_2
A3
  Bottom 0.406: IC1.26 J12.A_3
A4
  Bottom 0.406: IC1.27 J12.A_4
A5
  Bottom 0.406: IC1.28 J12.A_5
AGND  (via drill 0.6)
  Top 0.406: R28.1 C18.1 30.48,38.73 30.48,37.46 29.84,36.83 21.59,36.83 19.05,34.29
  Bottom 0.406: C12.1 52.07,33.34 51.44,33.97 51.44,37.78 51.12,38.1
  Bottom 0.61: J2.1 J5.1 J7.1 61.04,2.62 60.96,2.54 60.6,2.54 J8.1 J10.1 J13.1 | J13.1 35.48,2.62 35.56,2.54 34.29,2.54 | J13.1 J15.1 J16.1 | 34.29,2.54 22.86,2.54 | J13.1 34.37,2.62 34.29,2.54
  other vias: 20,32.7
  pour Bottom (isolate 0.406, hatched): -1.9,34.29 46.99,34.29 46.99,45.72 116.2,45.72 116.2,-1.91 -1.9,-1.91
  pour Top (isolate 0.406, hatched): -2.54,34.29 46.99,34.29 46.99,45.72 116.2,45.72 116.2,-2.54 -2.54,-2.54
AREF  (via drill 0.6)
  Top 0.406: v89.85,51.44 87.63,51.44 85.09,53.98 v85.09,67.95 | C5.2 v48.26,79.06 | v92.39,34.92 91.44,34.92 89.85,33.34 v89.85,30.48
  Bottom 0.406: v89.85,51.44 92.71,48.58 92.71,41.91 93.98,40.64 93.98,36.51 v92.39,34.92 | IC1.21 51.44,74.45 48.26,77.63 v48.26,79.06 | C5.2 54.93,85.73 67.31,85.73 68.58,84.46 68.58,80.65 69.85,79.38 80.01,79.38 85.09,74.3 v85.09,67.95 | J12.AREF 74.93,29.21 88.58,29.21 v89.85,30.48
BUTTON  (via drill 0.6)
  Top 0.406: v42.55,43.18 42.55,50.8 | 42.55,50.8 43.82,52.07 R14.2 | 42.55,50.8 41.28,52.07 29.84,52.07 29.21,52.7 v29.21,57.15
  Bottom 0.406: IC1.6 46.36,60.96 43.82,58.42 R14.2 | v29.21,57.15 27.3,57.15 18.73,65.72 16.83,65.72 15.72,66.83 15.72,68.1 11.43,72.39 BUTTON.P$1
  Bottom 0.61: J12.4 43.82,38.18 42.55,39.45 v42.55,43.18
CS1
  Bottom 0.406: IC1.16 64.14,68.26 62.87,66.99 62.87,60.96 61.59,59.69 61.59,40.01 64.14,37.46 64.14,33.66 64.77,33.02 64.77,27.3 64.14,26.67 62.23,26.67 J12.10
CS2  (via drill 0.6)
  Top 0.406: IC1.15 68.58,69.53 73.03,69.53 75.56,66.99 75.56,58.42 74.93,57.78 v74.93,55.88 69.85,50.8 v62.87,50.8 v59.05,50.8
  Bottom 0.406: J12.9 58.42,33.02 59.05,33.66 v59.05,50.8 | v74.93,55.88 80.01,60.96 R19.1 | v62.87,50.8 IC2.10
GND  (via drill 0.6)
  Top 0.406: 109.22,48.26 104.78,43.81 J14.6 J14.5 | ROUTER.4 ROUTER.6 76.2,32.38 81.28,32.38 ROUTER.12 | J17.2 68.58,47.62 67.31,48.89 | J4.6 105.1,67.64 105.41,67.95 | J6.1 17.78,33.02 17.78,36.2 | J11.6 56.52,76.84 J12.GND2
  Bottom 0.406: 65.09,48.26 65.41,47.94 IC2.9 68.58,43.18 72.39,39.37 ROUTER.4 71.12,32.38 J12.GND0 | ROUTER.12 ROUTER.11 | C2.2 56.52,53.02 v56.52,49.53
  Bottom 1.27: C2.2 | C2.2 56.67,52.86
  other vias: 48.9,66.2
  pour Bottom (isolate 0.406, hatched): -1.9,35.56 45.72,35.56 45.72,46.99 116.2,46.99 116.2,90.17 -1.96,90.2
  pour Top (isolate 0.406, hatched): -1.9,89.85 116.52,89.85 116.52,46.99 45.72,46.99 45.72,35.56 -1.9,35.88
MISO  (via drill 0.6)
  Top 0.305: IC1.18 59.05,73.66 60.33,74.93 60.33,77.15 60.96,77.79 66.67,77.79 67.63,78.74 67.63,82.23 J11.1
  Top 0.406: v64.14,47.62 v57.79,47.62
  Bottom 0.406: IC1.18 59.05,68.26 57.79,66.99 57.79,61.28 59.37,59.69 59.37,53.34 57.79,51.75 v57.79,47.62 IC2.12 | J12.12 66.04,33.66 67.31,34.92 67.31,36.83 64.14,40.01 v64.14,47.62
MOSI
  Bottom 0.406: J11.4 63.5,79.38 66.17,76.71 66.17,75.18 65.28,74.3 62.36,74.3 61.59,73.53 IC1.17 61.59,68.26 60.33,66.99 IC2.11 60.33,38.73 61.59,37.46 61.59,32.38 63.5,30.48 J12.11
N$1
  Top 0.61: R11.2 R7.2
  Bottom 0.61: R11.2 R6.1 C3.2
N$2
  Top 0.61: J15.5 27.13,8.43 24.76,10.8 C20.1
N$3
  Top 0.61: J16.5 14.43,8.43 12.07,10.8 C22.1
N$4  (via drill 0.6)
  Top 0.406: C16.2 | C16.2 102.23,26.67 102.23,20.32 R6.2 | IC3.2 71.12,43.18 67.31,39.37
  Top 0.61: IC2.15 50.16,41.27 52.07,39.37 v53.98,39.37 67.31,39.37
  Bottom 0.406: v53.98,39.37 53.98,20.32 R23.2 | R29.2 36.2,19.05 38.1,17.14 R26.2
  Bottom 0.61: R6.2 100.97,19.05 96.84,14.92 94.93,14.92 R12.2 88.27,19.05 84.14,14.92 82.23,14.92 R16.2 75.56,19.05 71.44,14.92 69.53,14.92 R20.2 63.18,19.05 59.05,14.92 54.29,14.92 52.71,16.51 R23.2 50.16,19.05 46.04,14.92 43.5,14.92 R26.2 | R32.2 18.73,14.92 20.64,14.92 24.76,19.05 R29.2
N$5
  Top 0.61: R15.2 R13.2
  Bottom 0.61: R15.2 R12.1 C7.2
N$6  (via drill 0.6)
  Top 0.406: 65.41,35.4 IC2.8 65.41,32.38 v67.31,30.48
  Bottom 0.406: 98.42,25.4 96.52,23.49 85.73,23.49 81.28,27.94 76.2,27.94 74.61,26.35 67.95,26.35 67.31,26.99 v67.31,30.48
  Bottom 0.61: R7.1 98.42,25.4 C6.2
N$7
  Top 0.61: J13.5 39.83,8.43 36.83,11.43 33.02,11.43 28.57,15.88 28.57,17.78 29.84,19.05 C15.1
N$8
  Top 0.61: J10.5 52.53,8.43 49.53,11.43 C13.1
N$9
  Top 0.61: C11.1 65.41,16.51 66.67,15.24 66.67,11.75 65.23,10.3 J8.5
N$10
  Bottom 0.61: J2.5 103.33,8.43 100.97,10.8 C3.1
N$11
  Top 0.61: J5.5 90.63,8.43 88.27,10.8 C7.1
N$12
  Top 0.61: J7.5 77.93,8.43 75.56,10.8 C9.1
N$13
  Top 0.305: IC2.7 62.87,33.02 66.67,29.21 79.38,29.21 82.23,26.35 86.68,26.35 C8.2
  Bottom 0.61: C8.2 R13.1
N$14
  Top 0.406: IC2.6 62.23,37.46 69.22,37.46 C10.2
  Bottom 0.406: IC2.6 60.33,29.84 59.69,29.21 59.69,24.77 60.96,23.49 76.58,23.49 R17.1
N$15
  Top 0.406: IC2.5 57.79,33.66 57.15,33.02 C12.2 57.15,25.91 58.04,25.02 R21.1
N$16
  Top 0.406: IC2.1 46.36,35.56 45.85,36.07 22.41,36.07 C23.2
  Bottom 0.406: R36.1 15.88,26.67 19.37,26.67 20,27.3 20,30.8 21.59,32.38 21.59,33.34 C23.2
N$17
  Top 0.406: IC2.2 50.16,33.15 49.53,32.51 48.13,32.51 45.34,35.31 29.65,35.31 C21.2
  Bottom 0.406: C21.2 28.64,26.73 R30.1
N$18  (via drill 0.6)
  Top 0.406: R28.2 34.92,43.18 33.66,41.91 33.66,39.05 R27.2 | R26.1 31.11,24.64 C15.2 29.84,29.53 v32.07,31.75
  Bottom 0.406: v32.07,31.75 R27.2
N$19
  Top 0.406: C18.2 39.37,40.32 R27.1 50.8,37.46 | 50.8,37.46 | 50.8,37.46 50.96,37.31 | 50.8,37.46 IC2.3
N$20
  Top 0.406: IC2.4 55.25,29.84 54.29,28.89 54.29,26.61 R24.1
  Top 0.61: C14.2 57.47,17.46 57.47,22.22 56.2,23.49 54.23,23.49 R24.1
N$21
  Bottom 0.61: C22.2 R32.1 R40.2 R36.2
N$22
  Top 0.61: R31.2 R30.2
  Bottom 0.61: R31.2 R29.1 C20.2
N$23  (via drill 0.6)
  Top 0.61: D1.A 27.3,40.01 v25.4,38.1
  Bottom 0.406: 13.97,31.75 12.54,33.18
  Bottom 0.61: 13.34,35.56 12.7,34.92 12.7,33.02 13.97,31.75 J9.2 | Q2.3 12.38,43.34 11.75,42.7 11.75,37.15 13.34,35.56 | v25.4,38.1 24.13,38.1 21.59,35.56 13.34,35.56
N$24
  Top 0.61: R25.2 R24.2
  Bottom 0.61: R23.1 R25.2 44.45,20.32 C13.2
N$25
  Top 0.406: R37.1 16.19,46.35 11.91,46.35 11.43,46.35 10.16,45.09 10.16,41.27 8.89,40.01 LED3.A
N$26
  Bottom 0.61: R21.2 R22.2 R20.1 57.47,19.05 58.42,18.1 C11.2
N$27
  Top 0.61: R18.2 R17.2
  Bottom 0.61: R18.2 R16.1 C9.2
N$28
  Bottom 0.406: IC1.9 53.98,60.01 Q1.2 52.71,54.93 C1.1
N$29
  Bottom 0.406: IC1.10 56.52,60.01 Q1.1 C2.1
N$30
  Bottom 0.406: C19.1 91.12,34.61 92.08,33.66 J14.1
N$31
  Bottom 0.406: D2.A 14.61,48.26 10.95,51.91
  Bottom 0.61: Q3.3 10.95,51.91 8.89,49.85 J9.4
N$32
  Bottom 0.305: Q2.2 13.65,40.64 14.61,39.69 17.14,39.69 19.05,41.59 19.05,45.72 19.68,46.35 23.18,46.35 R33.2
N$33
  Bottom 0.61: R38.1 16.19,55.88 13.34,55.88 11.43,55.88 7.62,52.07 7.62,46.99 6.35,45.72 LED4.A
N$34
  Bottom 0.406: Q3.2 R34.2
N$35
  Bottom 0.406: D3.A 14.61,57.78 9.53,62.87
  Bottom 0.61: Q4.3 9.53,62.87 9.21,62.87 5.08,58.74 3.49,58.74 1.91,57.15 1.91,36.2 3.81,34.29 J9.6
N$36
  Top 0.61: LED5.A | LED5.A 10.16,57.15 10.16,63.5 11.43,64.77 15.88,64.77 16.51,64.14 R39.1
N$37
  Bottom 0.406: Q4.2 R35.2
N$38
  Top 0.61: R8.1 1.91,64.77 1.91,59.69 LED2.A
N$39
  Top 0.406: LED1.A 7.62,62.87 8.89,64.14 8.89,76.2 10.16,77.47 R4.1 | R4.1
N$40
  Top 0.61: J1.1 104.9,12.19 104.14,11.43 94.49,11.43 J2.2
  Bottom 0.61: J16.2 4.75,10.46 5.71,11.43 7.62,11.43 8.59,10.46 J15.2 18.29,11.43 20.32,11.43 21.29,10.46 J13.2 30.99,11.43 33.02,11.43 33.98,10.46 J10.2 43.69,11.43 45.72,11.43 46.69,10.46 J8.2 56.39,11.43 58.42,11.43 59.39,10.46 J7.2 69.09,11.43 71.12,11.43 72.09,10.46 J5.2 81.79,11.43 83.82,11.43 84.78,10.46 J2.2
RELAY1  (via drill 0.6)
  Top 0.406: IC1.12 61.59,58.42 60.33,57.15 48.26,57.15 47.62,57.78 32.38,57.78 30.48,59.69 20.95,59.69 19.05,57.78 19.05,46.99 20.95,45.09 R37.2 30.8,48.26 R33.1
  Top 0.61: J12.6 48.9,29.34 43.94,34.29 v30.48,34.29
  Bottom 0.406: v30.48,34.29 30.48,43.81 29.21,45.09 R37.2
RELAY2  (via drill 0.6)
  Top 0.406: R38.2 R34.1 28.89,50.16 35.56,50.16 | IC1.13 64.14,53.98 62.23,52.07 45.72,52.07 44.45,50.8 v44.45,41.91 41.91,41.91 40.96,42.86 40.96,44.77 35.56,50.16 | 35.56,50.16 35.72,50.01
  Bottom 0.406: v44.45,41.91 44.45,39.69 45.4,38.73 45.4,33.97 J12.7
RELAY3  (via drill 0.6)
  Top 0.406: R35.1 R39.2 30.16,64.14 32.7,61.59 v52.71,61.59 52.71,65.72 53.34,66.36 66.04,66.36 66.67,65.72 IC1.14
  Bottom 0.406: J12.8 55.88,33.02 56.52,33.66 56.52,38.73 53.98,41.27 53.98,50.16 50.8,53.34 50.8,58.42 52.71,60.32 v52.71,61.59
RESET  (via drill 0.6)
  Top 0.406: IC1.1 31.75,65.72 v31.75,73.03 32.7,73.98 50.8,73.98 52.71,75.88 v52.71,79.38 | 82.55,53.66 82.55,53.34 87.63,48.26 C19.2 | 82.55,53.66 82.55,54.29 | 82.55,53.66 82.55,73.66 80.01,76.2 J12.RESET
  Bottom 0.406: IC1.1 R3.2 | J12.RESET 60.96,79.38 59.69,79.38 59.05,80.01 | 59.05,80.01 59.05,81.92 J11.5 | v52.71,79.38 58.42,79.38 59.05,80.01 | RESET.P$2 6.35,76.2 7.62,77.47 17.78,77.47 22.22,73.03 v31.75,73.03
RXD  (via drill 0.6)
  Top 0.406: IC1.2 36.2,67.31 37.47,68.58 71.12,68.58 74.3,65.41 R1.2 | J14.3 97.16,33.66 82.55,48.26 v82.55,49.53
  Bottom 0.406: IC1.2 36.2,61.59 37.21,60.58 37.21,47.37 36.2,46.35 34.92,46.35 33.66,45.09 J12.0_RX | R1.2 74.3,60.96 73.66,60.32 73.66,50.8 74.93,49.53 v82.55,49.53
SCK  (via drill 0.6)
  Top 0.254: J11.3 62.23,82.55 59.05,82.55
  Top 0.305: IC1.19 56.52,73.66 55.25,74.93 55.25,78.74 59.05,82.55
  Top 0.406: IC2.13 55.25,41.27 55.88,40.64 v65.41,40.64
  Bottom 0.406: IC1.19 56.52,68.26 55.25,66.99 55.25,56.83 53.98,55.56 53.98,53.02 55.25,51.75 IC2.13 | v65.41,40.64 68.58,37.46 J12.13
SIN  (via drill 0.6)
  Top 0.406: 73.03,71.12 R2.1 78.42,65.72 78.42,46.99 83.82,41.59 v83.82,40.01
  Bottom 0.406: R5.2 75.56,71.44 72.71,71.44 R2.1 | v83.82,40.01 83.82,32.38 ROUTER.13
SOUT
  Top 0.406: R1.1 81.28,66.04 81.28,45.72 86.36,40.64 86.36,34.92 ROUTER.14
STATUS_LED  (via drill 0.6)
  Top 0.406: v22.86,65.72 22.86,68.58 30.48,76.2 R4.2
  Bottom 0.406: J12.3 41.28,36.2 40.64,36.83 40.64,59.47 43.82,62.64 IC1.5 43.82,65.41 43.18,66.04 29.84,66.04 29.53,65.72 v22.86,65.72
TXD  (via drill 0.6)
  Top 0.406: IC1.3 38.73,66.68 39.37,67.31 70.48,67.31 71.12,66.68 R2.2 | J14.2 94.62,34.29 v82.55,46.35
  Bottom 0.406: J12.1_TX 36.2,36.83 38.42,39.05 38.42,40.96 37.21,42.16 37.21,46.1 38.23,47.12 38.23,60.45 38.73,60.96 IC1.3 | R2.2 71.12,49.85 72.39,48.58 80.33,48.58 v82.55,46.35
USB_CS  (via drill 0.6)
  Top 0.406: v86.04,46.35 87.95,44.45 R10.1 101.6,50.8 J3.2 109.22,50.8 109.86,51.44 109.86,70.48 108.31,72.04 J4.2
  Bottom 0.406: v86.04,46.35 86.04,44.61 81.28,39.85 81.28,32.38 ROUTER.9
USB_MISO  (via drill 0.6)
  Top 0.406: J3.3 100.97,53.34 93.34,45.72 88.58,45.72 87.31,46.99 v85.73,48.58 | J4.7 105.55,66.53 106.68,65.41 v106.68,63.5
  Bottom 0.406: v85.73,48.58 84.45,47.31 84.45,45.09 83.19,43.81 80.64,43.81 78.74,41.91 78.74,34.92 ROUTER.10 | v106.68,63.5 108.59,61.59 108.59,53.98 107.95,53.34 J3.3
USB_MOSI  (via drill 0.6)
  Top 0.406: v77.47,44.45 76.52,45.4 75.25,45.4 73.66,46.99 73.66,50.8 v76.84,53.98 | v86.36,56.83 v97.79,56.83 v97.79,67.31 | J4.3 98.61,70.94 v97.79,71.76
  Bottom 0.406: ROUTER.8 v77.47,44.45 | v76.84,53.98 83.5,53.98 v86.36,56.83 | v97.79,56.83 100.65,56.83 101.6,55.88 J3.4 | v97.79,67.31 v97.79,71.76
USB_SCK  (via drill 0.6)
  Top 0.406: v75.56,47.31 75.56,50.16 v76.84,51.44 | J4.5 107.16,68.73 108.59,67.31 108.59,59.05 107.95,58.42 J3.5 101.6,58.42 95.89,52.7 88.27,52.7 v86.36,54.61
  Bottom 0.406: v75.56,47.31 75.56,43.18 73.66,41.27 73.66,32.38 ROUTER.5 | v76.84,51.44 83.19,51.44 v86.36,54.61

### Text on the board
Reference: smartenergygroups.com | SEGmeter v2.0 | 1 | Hardware design by Luke Weston, 2011 | Open Hardware | A5 | A4 | A3 | A2 | A1 | A0 | +12V | GND | GND | +5V | +3.3 | RST | RESET | INPUT SWITCH | MICRO-SD CARD | +5V | GPIO0 | GPIO1 | GPIO3 | GPIO4 | GND | 4.096 V | APPLY SOLDER JUMPER | 100 nF | ROUTER | RELAY OUTPUT STATUS | ARDUINO COMPATIBLE | +3.3V | SERIAL PROGRAMMING / COMMS | 12V RELAYS | GPIO1 | GPIO3 | GND | ROU TX | DTR | TXD | RXD | +5V | GND | GND | 1 | 1 | 2 | 3 | GND | +5V | 0 | 1 | 2 | 3 | 4 | 5 | 6 | 7 | 8 | 9 | 10 | 11 | 12 | 220 k | 220 k | 5 V to Sensors | 1 | 2 | 3 | 4 | 5 | 6 | 7 | 8